# Altium schematic sheet finalFilter2.SchDoc
size A4
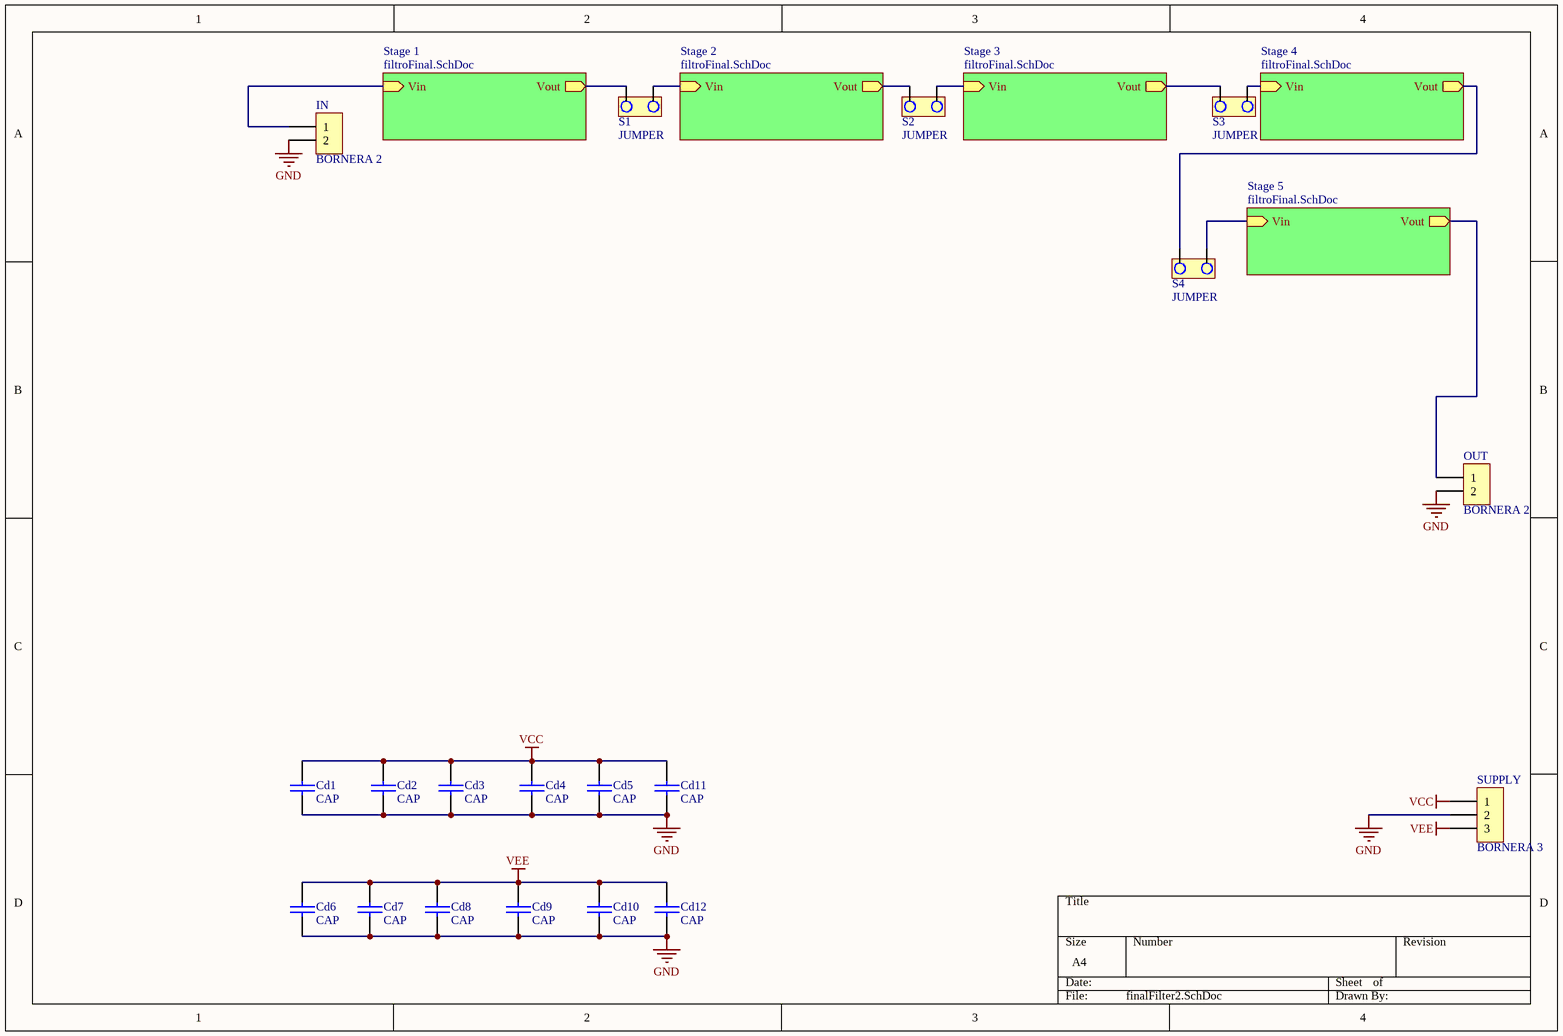
[diagram p0: finalFilter2.SchDoc]

## Parts
Cd1  CAP  [CAP200]
Cd2  CAP  [CAP200]
Cd3  CAP  [CAP200]
Cd4  CAP  [CAP200]
Cd5  CAP  [CAP200]
Cd6  CAP  [CAP200]
Cd7  CAP  [CAP200]
Cd8  CAP  [CAP200]
Cd9  CAP  [CAP200]
Cd10  CAP  [CAP200]
Cd11  CAP  [CAP200]
Cd12  CAP  [CAP200]
IN  BORNERA 2  [BORNERA2]
OUT  BORNERA 2  [BORNERA2]
S1  JUMPER  [JUMPER2]
S2  JUMPER  [JUMPER2]
S3  JUMPER  [JUMPER2]
S4  JUMPER  [JUMPER2]
SUPPLY  BORNERA 3  [BORNERA3]

## Sub-sheets
Stage 1 = filtroFinal.SchDoc: Vin (in), Vout (out)
Stage 2 = filtroFinal.SchDoc: Vin (in), Vout (out)
Stage 3 = filtroFinal.SchDoc: Vin (in), Vout (out)
Stage 4 = filtroFinal.SchDoc: Vin (in), Vout (out)
Stage 5 = filtroFinal.SchDoc: Vin (in), Vout (out)

## Nets
GND: Cd1.2 Cd2.2 Cd3.2 Cd4.2 Cd5.2 Cd6.2 Cd7.2 Cd8.2 Cd9.2 Cd10.2 Cd11.2 Cd12.2 IN.2 OUT.2 SUPPLY.2
VCC: Cd1.1 Cd2.1 Cd3.1 Cd4.1 Cd5.1 Cd11.1 SUPPLY.1
VEE: Cd6.1 Cd7.1 Cd8.1 Cd9.1 Cd10.1 Cd12.1 SUPPLY.3
NetIN_1: IN.1 ; sheet Stage 1/Vin
NetOUT_1: OUT.1 ; sheet Stage 5/Vout
NetS1_1: S1.1 ; sheet Stage 1/Vout
NetS1_2: S1.2 ; sheet Stage 2/Vin
NetS2_1: S2.1 ; sheet Stage 2/Vout
NetS2_2: S2.2 ; sheet Stage 3/Vin
NetS3_1: S3.1 ; sheet Stage 3/Vout
NetS3_2: S3.2 ; sheet Stage 4/Vin
NetS4_1: S4.1 ; sheet Stage 4/Vout
NetS4_2: S4.2 ; sheet Stage 5/Vin